# Altium schematic sheet PLD_RadFET_Current_Source.SchDoc: Voltage adjustable current source
size A4; Revision: 1; SheetTotal: 32; Model: DM1
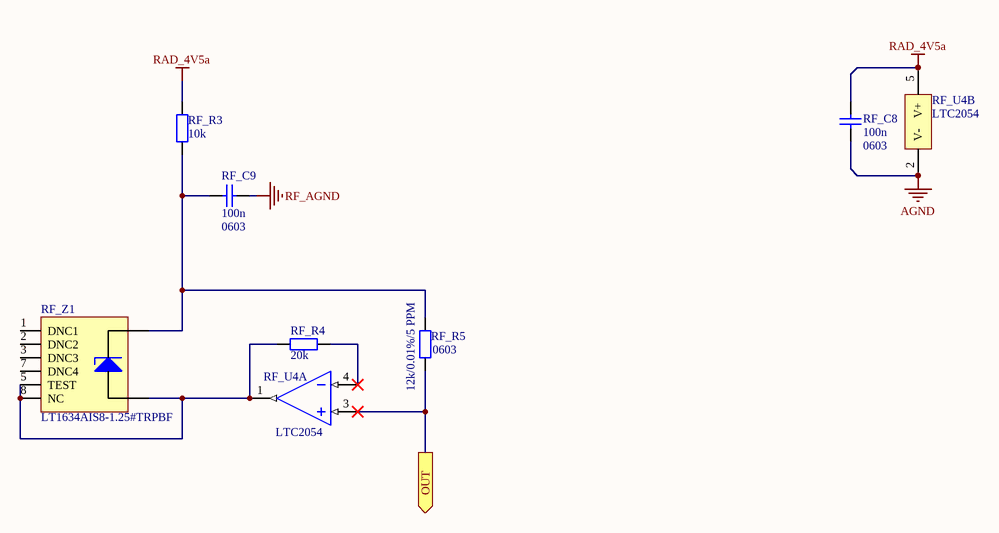
[diagram p0: PLD_RadFET_Current_Source.SchDoc]

## Parts
RF_C8  value 100n  Package: 0603  [SMD_Capacitor_0603]  (hidden comment: Cap)
RF_C9  value 100n  Package: 0603  [SMD_Capacitor_0603]  (hidden comment: Cap)
RF_R3  10k  [SMD_Resistor_0603]
RF_R4  20k  [SMD_Resistor_0603]
RF_R5  Package: 0603  [SMD_Resistor_0603]  (hidden comment: 12k/0.01%/5 PPM)
RF_U4  LTC2054  [SOT23-5]  (parts A,B of 2)
RF_Z1  1.25V  [SOIC-8-N]  (value not drawn)

## Ports
OUT (out)

## Nets
AGND: RF_C8.2 RF_U4.2(V-)
RAD_4V5a: RF_C8.1 RF_R3.1 RF_U4.5(V+)
RF_AGND: RF_C9.1
OUT: RF_R5.2 RF_U4.3(IN+_A) ; port OUT
NetRF_C9_2: RF_C9.2 RF_R3.2 RF_R5.1 RF_Z1.6(K)
NetRF_R4_1: RF_R4.1 RF_U4.1(OUT_A) RF_Z1.4(A) RF_Z1.5(TEST) RF_Z1.8(NC)
NetRF_R4_2: RF_R4.2 RF_U4.4(IN-_A)

Not connected (* = marked no-connect by the designer): RF_Z1 1(DNC1) 2(DNC2) 3(DNC3) 7(DNC4)

## Notes on the sheet
- Title:
- Project:
- Author:
- Model:
- Document Number:
- Checked by:
- Rev:
- Date:
- Approved by:
- Sheet:
- of
- File name:

## Library data of the parts
RF_R3-RF_R5 = Res
  RF_R3: Value: 10k; Package: 0603
  RF_R4: Value: 20k; Package: 0603
  RF_R5: Value: 12k/0.01%/5 PPM
RF_U4 = LTC2054: Single/Dual Micropower  Zero-Drift Operational Amplifi ers; Manufacturer: Linear Technology; Value: LTC2054
RF_Z1 = LT1634AIS8-1.25#TRPBF: Micropower Precision  Shunt Voltage Reference; Manufacturer: Linear; Value: 1.25V; ManufacturerPartNumber: LT1634AIS8-1.25#TRPBF